# EasyEDA schematic P05_PVDF.json
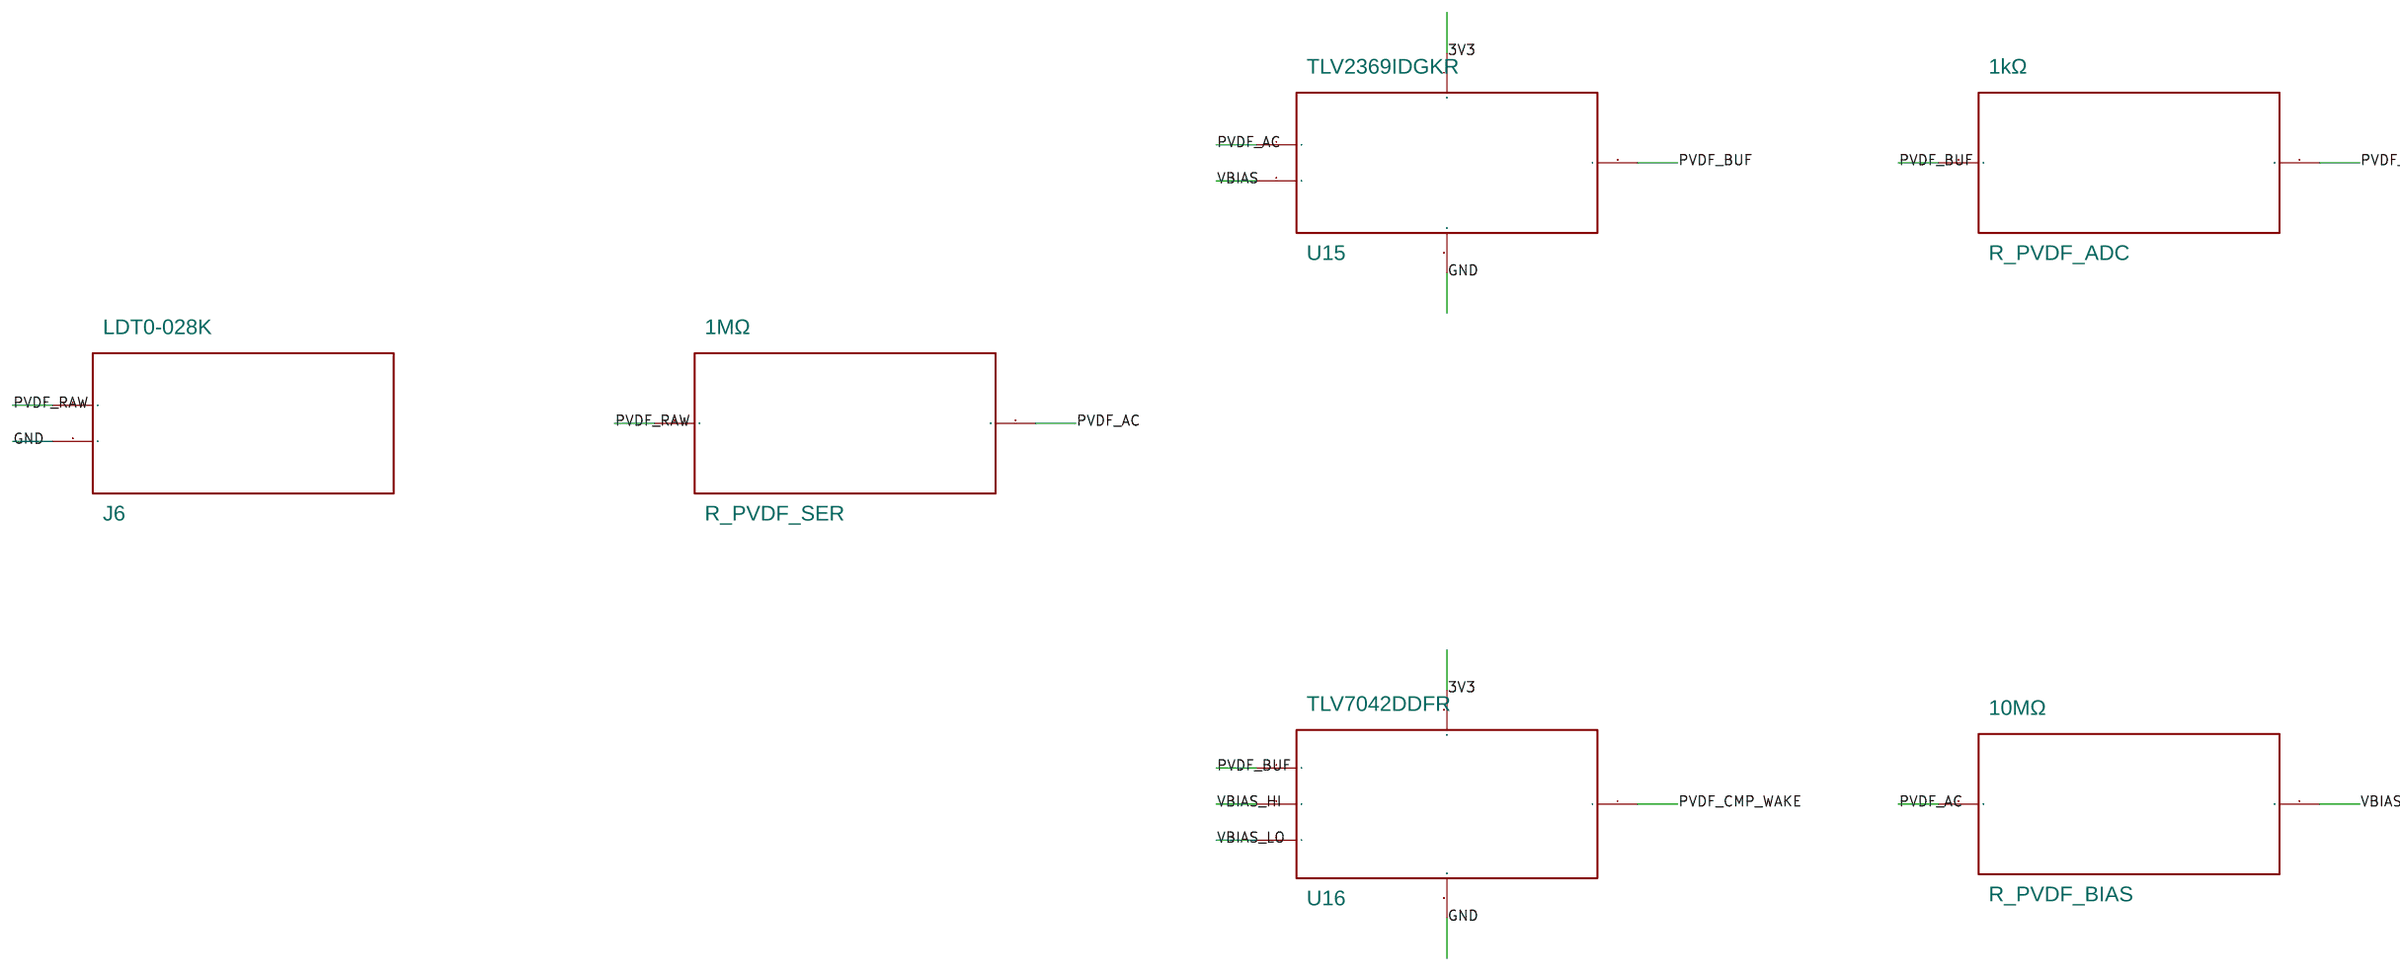
[diagram p0: schematic sheet]

## Parts
J6  LDT0-028K  [PVDF-2P]
R_PVDF_ADC  1kΩ  [R-0603]
R_PVDF_BIAS  10MΩ  [R-0603]
R_PVDF_SER  1MΩ  [R-0603]
U15  TLV2369IDGKR  [VSSOP-8]
U16  TLV7042DDFR  [SOT-23-8]

## Library data of the parts
J6 = PVDF
R_PVDF_ADC R_PVDF_BIAS R_PVDF_SER = Resistor
U15 = OpAmp
U16 = Comparator

## Nets
3V3: U15.4(1) U16.5(1)
GND: J6.2(1) U15.5(1) U16.6(1)
PVDF_AC: R_PVDF_BIAS.1 R_PVDF_SER.2(1) U15.1
PVDF_ADC: R_PVDF_ADC.2(1)
PVDF_BUF: R_PVDF_ADC.1 U15.3(1) U16.1
PVDF_CMP_WAKE: U16.4(1)
PVDF_RAW: J6.1 R_PVDF_SER.1
VBIAS: R_PVDF_BIAS.2(1) U15.2(1)
VBIAS_HI: U16.2(1)
VBIAS_LO: U16.3(1)

## Notes on the sheet
- P05  LDT0-028K PVDF 限流、偏置、钳位、比较器与 ADC
- IO9=ADC1_CH8 二次确认；IO11 仅低功耗唤醒，事件来源 physical_pvdf。
- 低漏钳位不画成默认 TVS；按器件漏电和 PVDF 高压瞬态实测选型。
- VBIAS≈1.65V（100k/100k + TLV2369 跟随）；比较窗口 VBIAS±150mV，开漏线与 100k 上拉。
- 钳位、阈值、滞回、消抖和 1M/10M 实际值均为可调初值，必须用目标木鱼壳体和示波器关闭。
